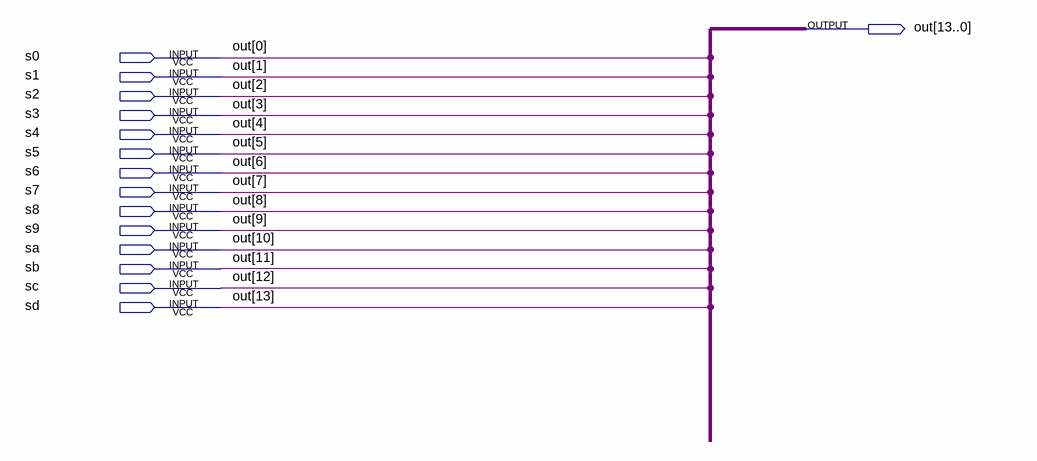
[diagram p0: schematic sheet]
// Quartus schematic s_gather.bdf as structural Verilog: 0 symbols, 15 pins
module s_gather (
  input  s0,
  input  s1,
  input  s2,
  input  s3,
  input  s4,
  input  s5,
  input  s6,
  input  s7,
  input  s8,
  input  s9,
  input  sa,
  input  sb,
  input  sc,
  input  sd,
  output [13:0] out
);


  assign out = {sd, sc, sb, sa, s9, s8, s7, s6, s5, s4, s3, s2, s1, s0};
endmodule
